# Altium schematic sheet QCopterFC_USB_Sch.SchDoc
size A4
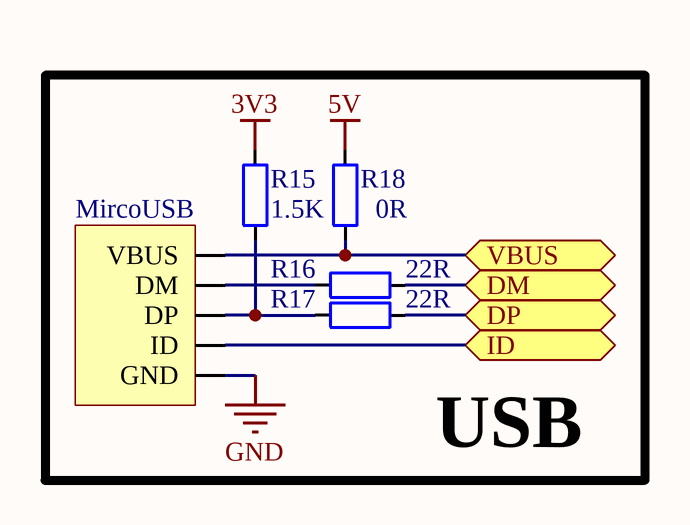
[diagram p0: QCopterFC_USB_Sch.SchDoc]

## Parts
MircoUSB  USB_Micro  [USB_Micro-AB]  (value not drawn)
R15  value 1.5K  [RES_0603]  (hidden comment: Res_0603)
R16  value 22R  [RES_0603]  (hidden comment: Res_0603)
R17  value 22R  [RES_0603]  (hidden comment: Res_0603)
R18  value 0R  [RES_0603]  (hidden comment: Res_0603)

## Blocks framed on the sheet
USB: MircoUSB R15-R18

## Ports
DM, DP, ID, VBUS

## Nets
3V3: R15.2
5V: R18.2
GND: MircoUSB.5(GND)
DM: R16.1 ; port DM
DP: R17.1 ; port DP
ID: MircoUSB.4(ID) ; port ID
VBUS: MircoUSB.1(VBUS) R18.1 ; port VBUS
NetMircoUSB_2: MircoUSB.2(DM) R16.2
NetMircoUSB_3: MircoUSB.3(DP) R15.1 R17.2

## Library data of the parts
MircoUSB = USB_Micro: USB
R15-R18 = Res_0603: Resistor